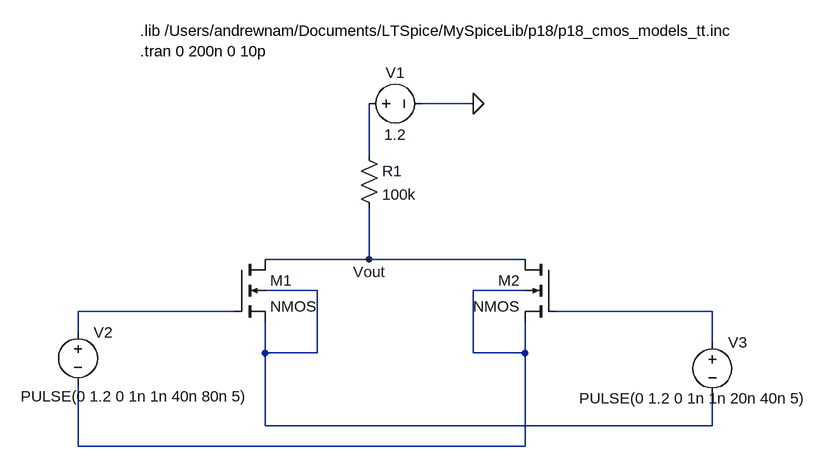
[diagram p0: schematic fig04_xnor.asc]
fig04_xnor.asc, the LTspice schematic file:
Version 4
SHEET 1 1328 680
WIRE 576 0 496 0
WIRE 416 80 416 0
WIRE 416 240 416 160
WIRE 416 240 256 240
WIRE 656 240 416 240
WIRE 336 288 256 288
WIRE 656 288 576 288
WIRE 208 320 -32 320
WIRE 944 320 704 320
WIRE -32 352 -32 320
WIRE 944 368 944 320
WIRE 256 384 256 336
WIRE 336 384 336 288
WIRE 336 384 256 384
WIRE 576 384 576 288
WIRE 656 384 656 336
WIRE 656 384 576 384
WIRE 256 496 256 384
WIRE 944 496 944 448
WIRE 944 496 256 496
WIRE -32 528 -32 432
WIRE 656 528 656 384
WIRE 656 528 -32 528
FLAG 576 0 0
FLAG 416 240 Vout
SYMBOL voltage 400 0 R270
WINDOW 0 32 56 VTop 2
WINDOW 3 -32 56 VBottom 2
SYMATTR InstName V1
SYMATTR Value 1.2
SYMBOL voltage -32 336 R0
WINDOW 3 -88 115 Left 2
SYMATTR InstName V2
SYMATTR Value PULSE(0 1.2 0 1n 1n 40n 80n 5)
SYMBOL voltage 944 352 R0
WINDOW 3 -205 102 Left 2
SYMATTR InstName V3
SYMATTR Value PULSE(0 1.2 0 1n 1n 20n 40n 5)
SYMBOL nmos4 704 240 M0
SYMATTR InstName M2
SYMATTR Value2 l=0.18u w=10u
SYMBOL nmos4 208 240 R0
SYMATTR InstName M1
SYMATTR Value2 l=0.18u w=10u
SYMBOL res 400 64 R0
SYMATTR InstName R1
SYMATTR Value 100k
TEXT 64 -112 Left 2 !.lib /Users/andrewnam/Documents/LTSpice/MySpiceLib/p18/p18_cmos_models_tt.inc\n.tran 0 200n 0 10p

The netlist it stands for:
* fig04_xnor.asc
V1 N001 0 1.2
V2 N004 N003 PULSE(0 1.2 0 1n 1n 40n 80n 5)
V3 N005 N002 PULSE(0 1.2 0 1n 1n 20n 40n 5)
M2 Vout N005 N003 N003 NMOS l=0.18u w=10u
M1 Vout N004 N002 N002 NMOS l=0.18u w=10u
R1 N001 Vout 100k
.model NMOS NMOS
.model PMOS PMOS
.lib standard.mos
.lib /Users/andrewnam/Documents/LTSpice/MySpiceLib/p18/p18_cmos_models_tt.inc
.tran 0 200n 0 10p
.backanno
.end